# EAGLE schematic ARKnew (EAGLE 9.4.2)
ESKD_DESCRIPTION1: 207|235|224|242|224|32|192|208|202; ESKD_DESCRIPTION2: 241|245|229|236|224|32|253|235|229|234|242|240|232|247|229|241|234|224|255; ESKD_DESCRIPTION3: 239|240|232|237|246|232|239|232|224|235|252|237|224|255; ESKD_NUMBER: 67|67|83|49|46|51|49|48|48|45|48|221|51; ESKD_NUMBER_SHEET: 49; ESKD_SHEETS: 49
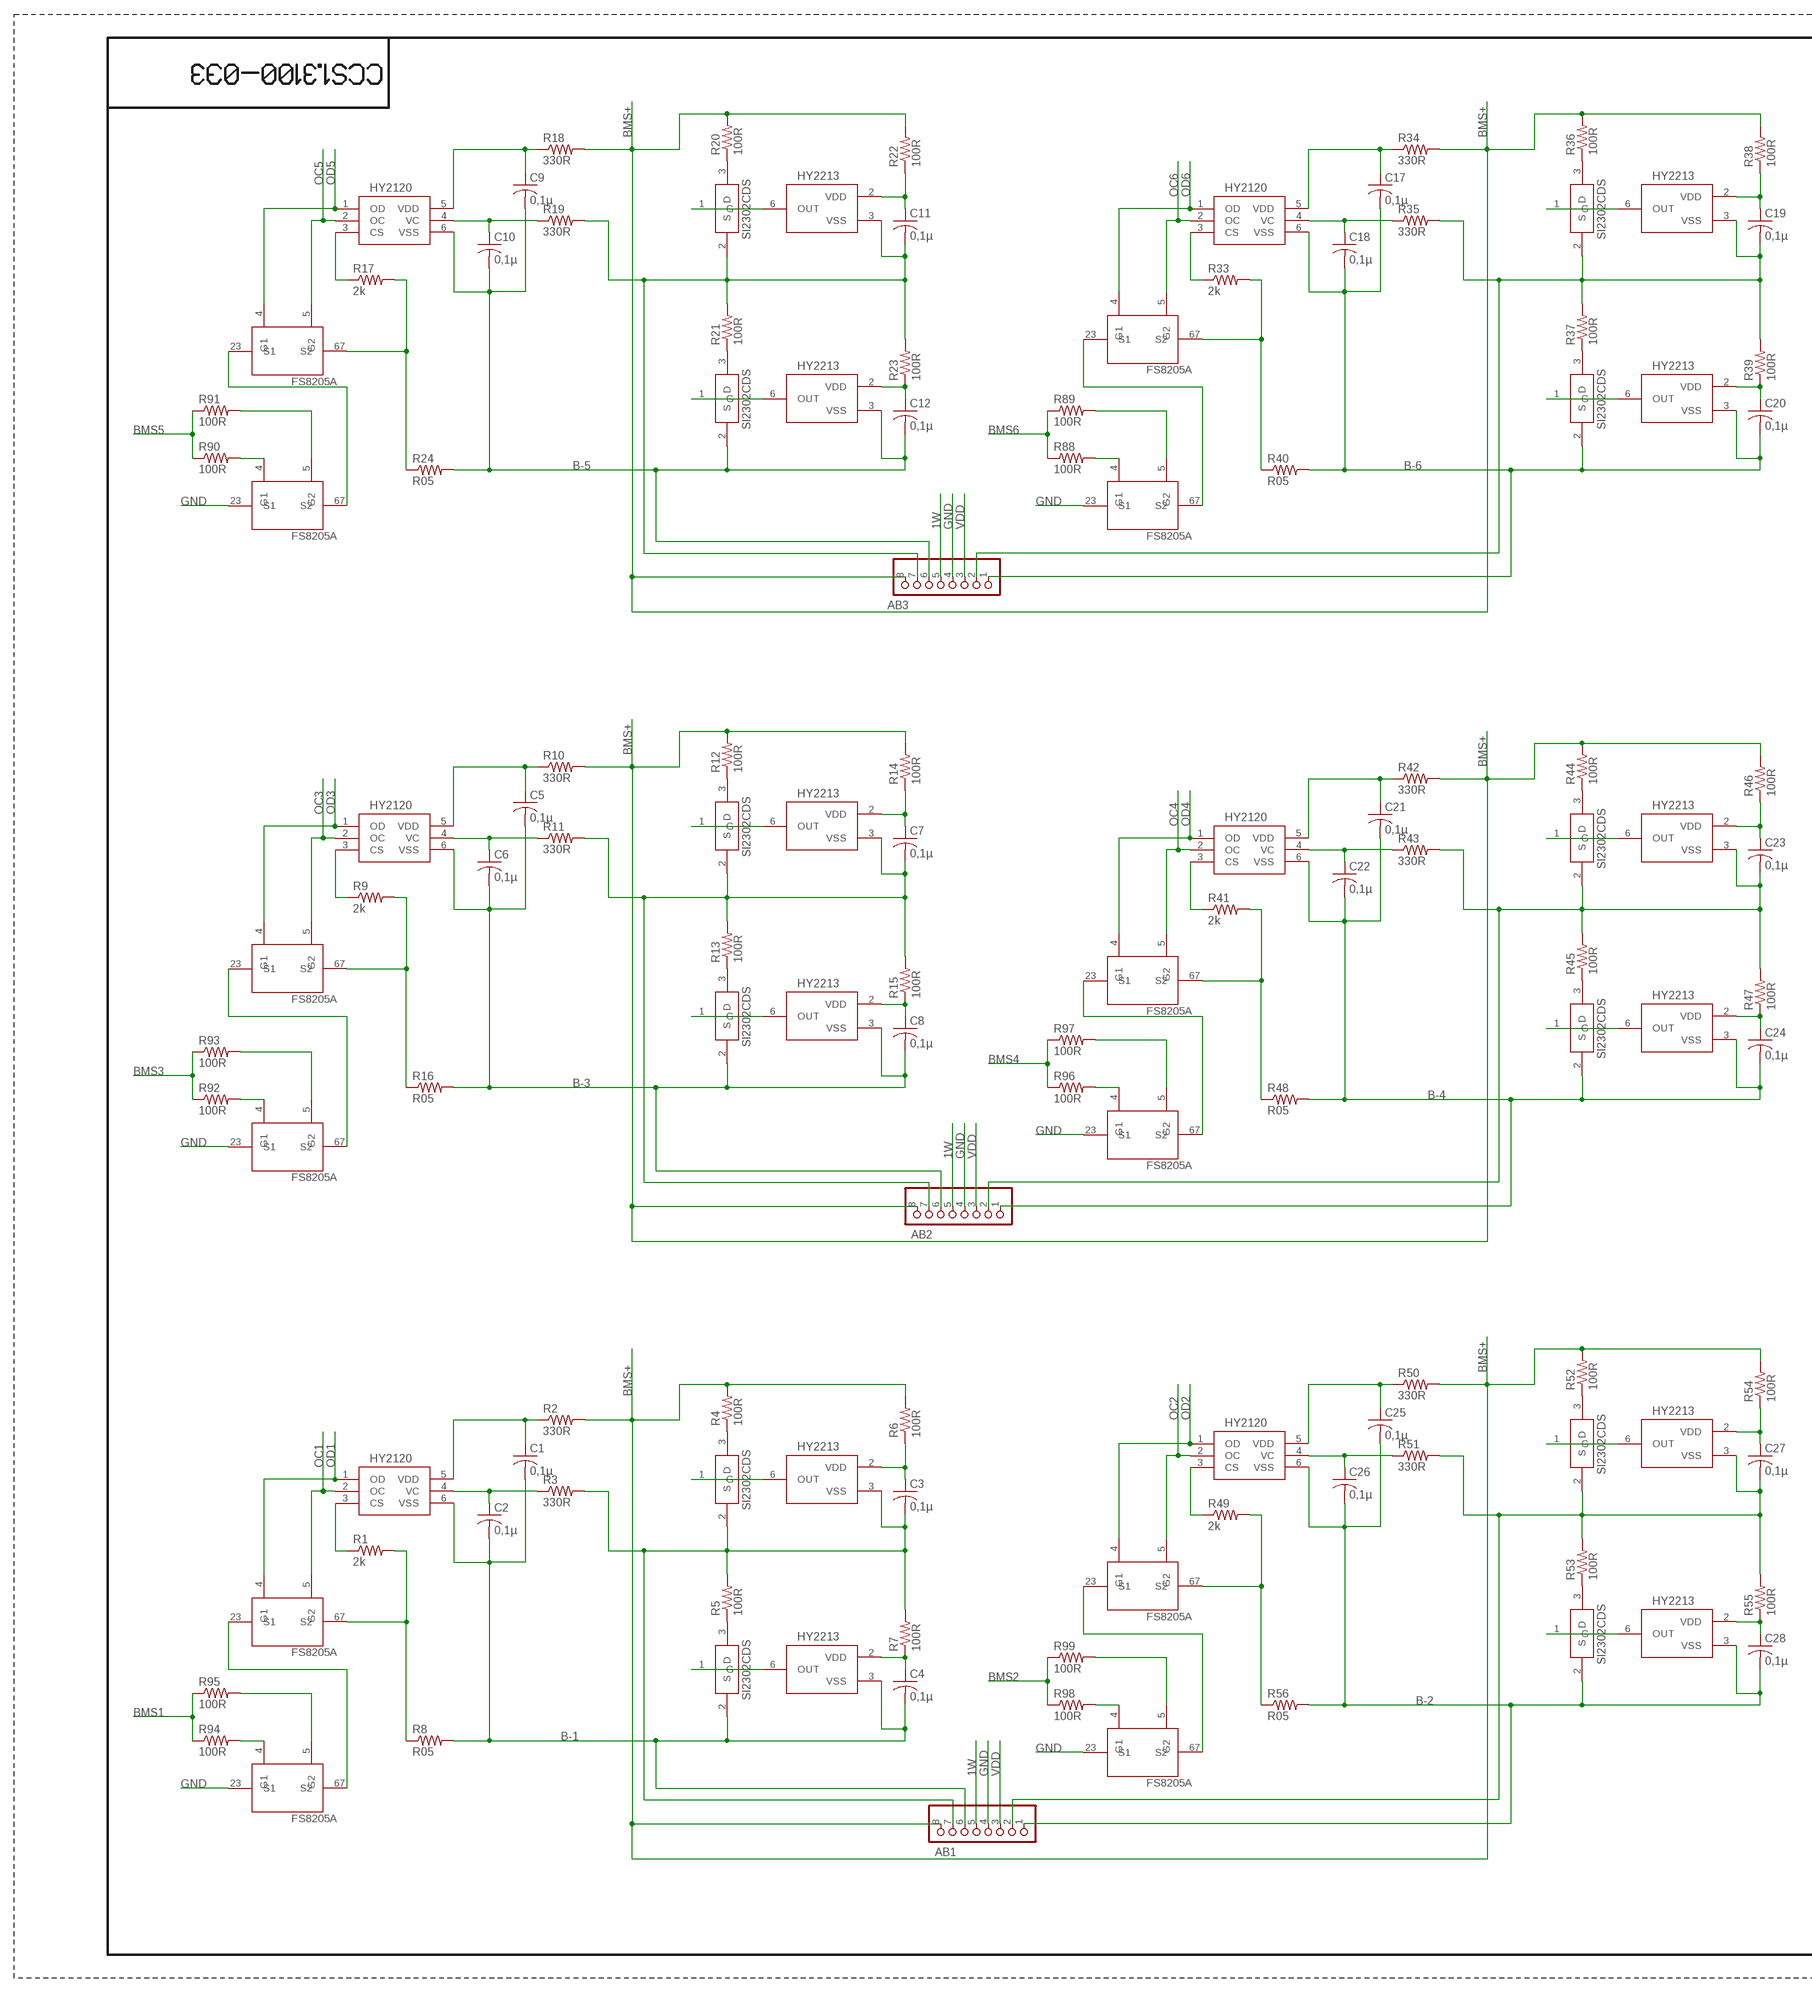
[diagram p0: schematic, sheet 1, part 1 of 2]
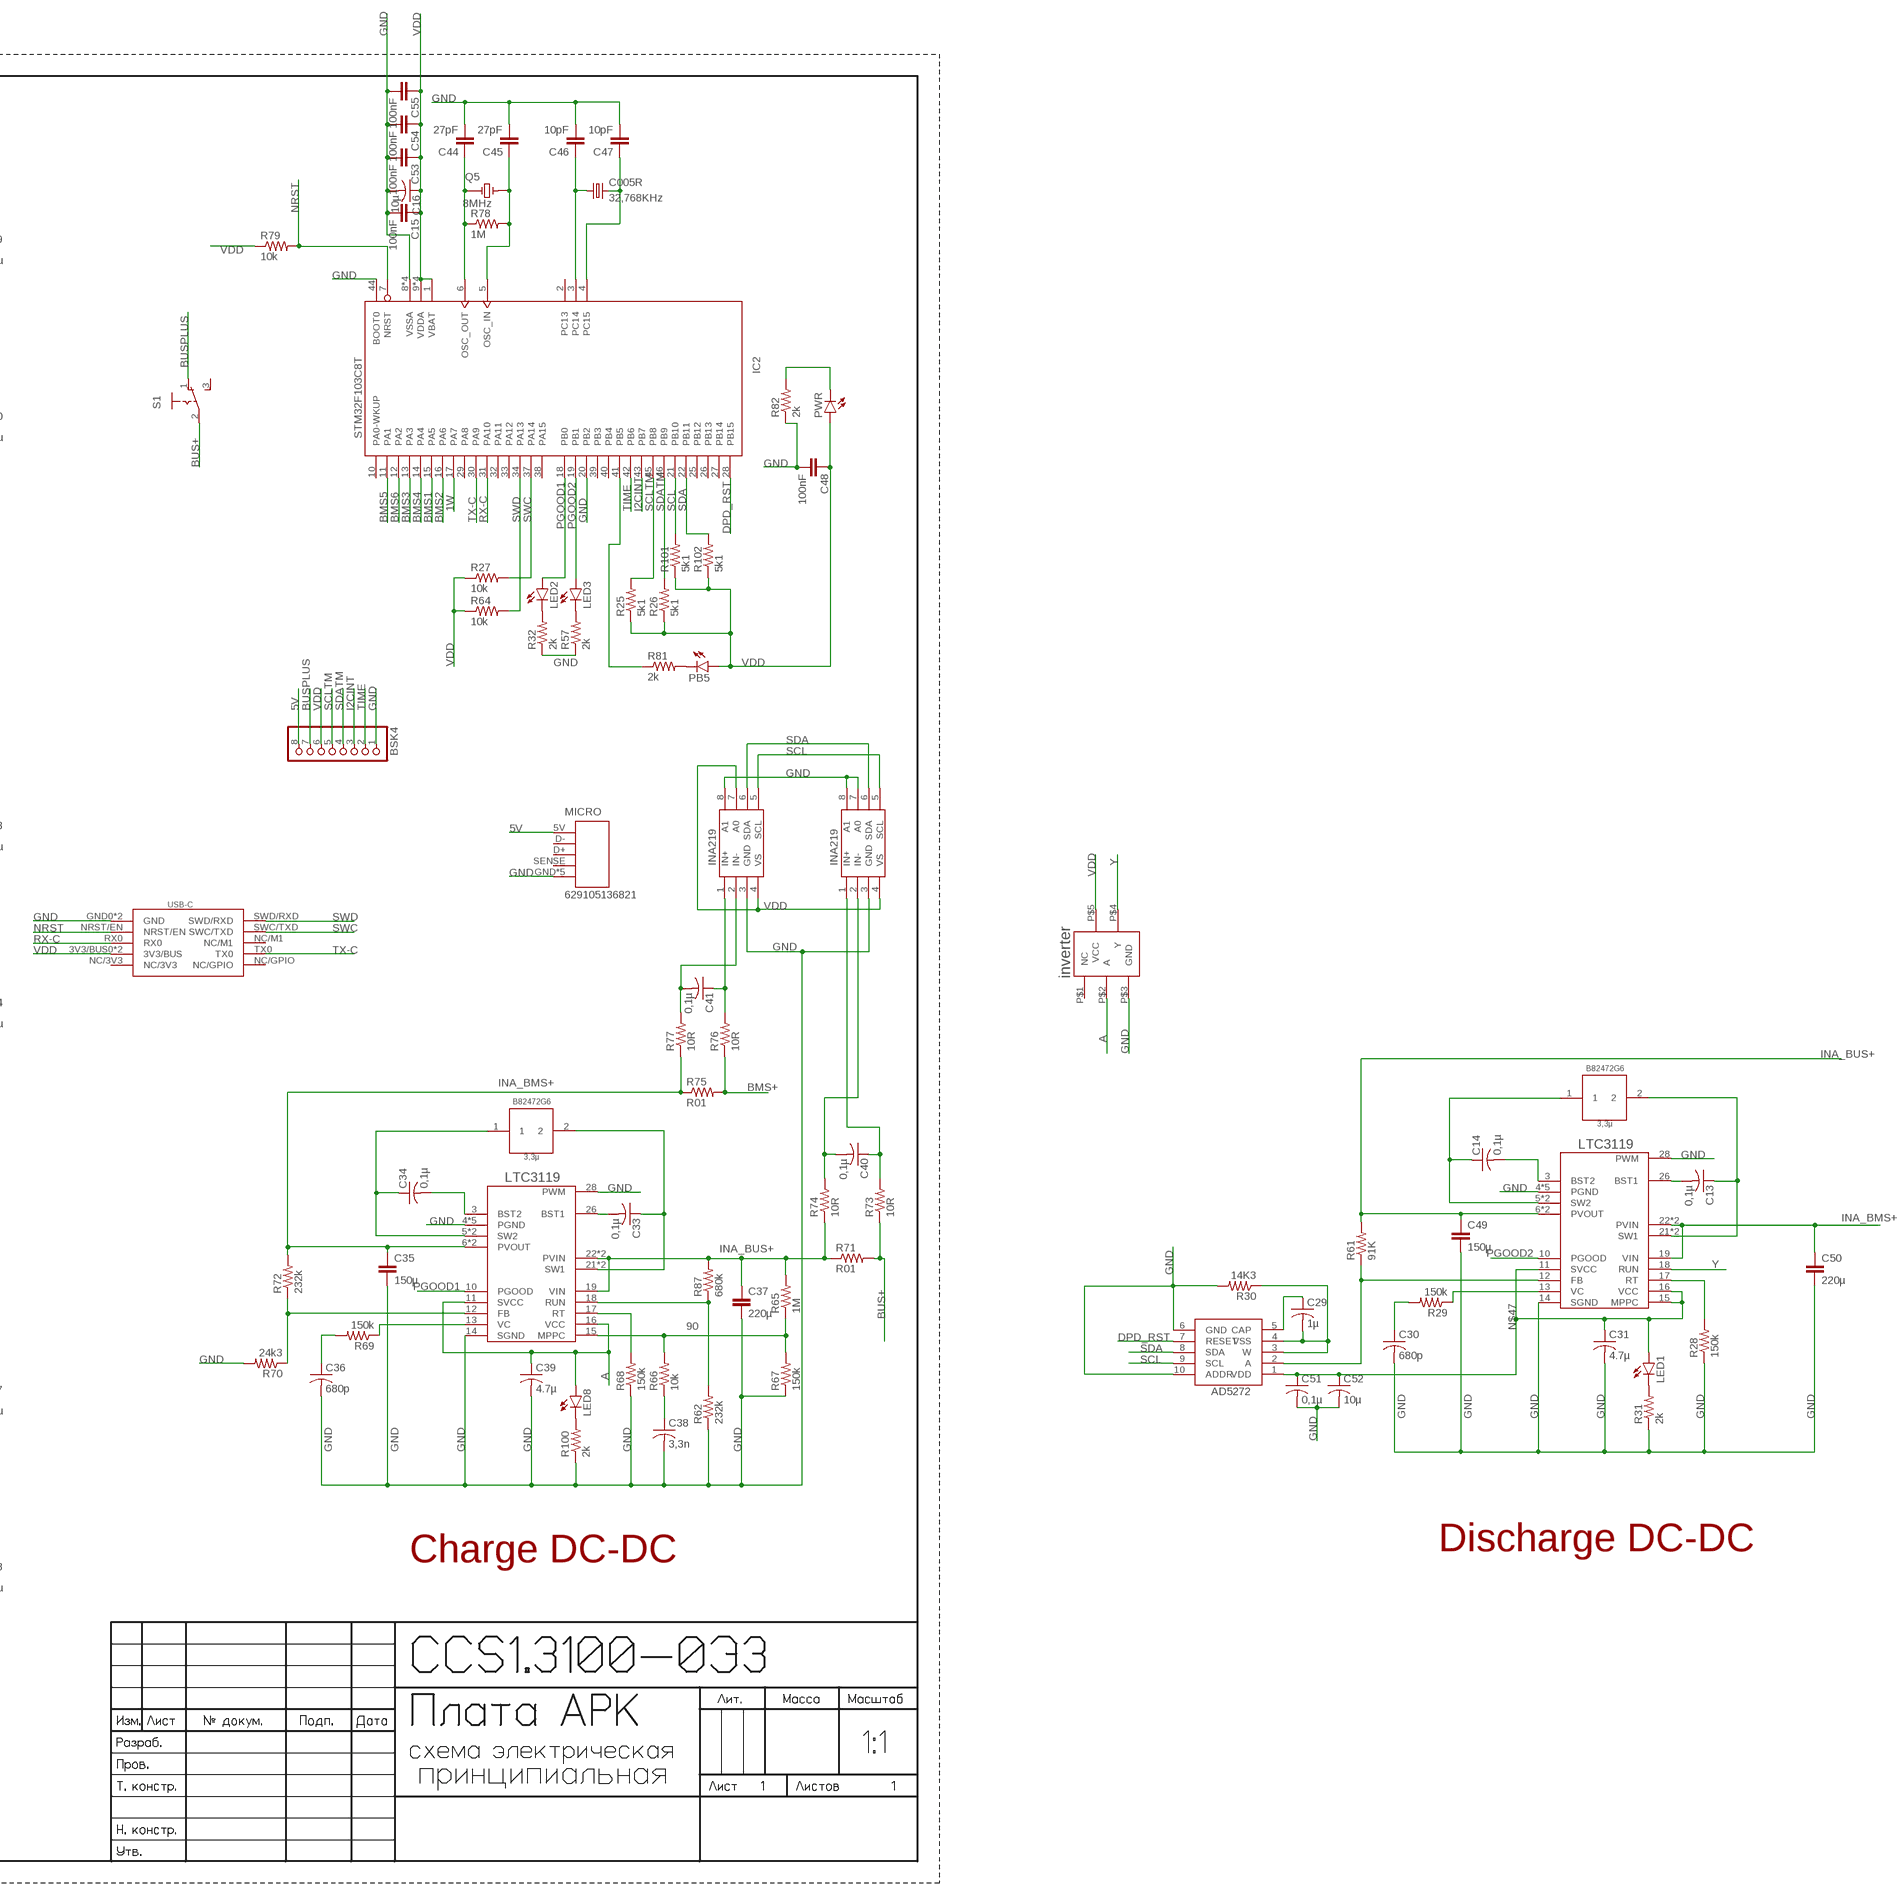
[diagram p1: schematic, sheet 1, part 2 of 2]

## Parts
3,3µH  3,3µ  B82472G6  [B82472G6]
3,3µH1  3,3µ  B82472G6  [B82472G6]
AB1  PINHD-1X8  [1X08]
AB2  PINHD-1X8  [1X08]
AB3  PINHD-1X8  [1X08]
AD5272#2  AD5272  [AD5272]
BSK4  PINHD-1X8  [1X08]
C1  0,1µ  C-USC0603  [C0603]
C2  0,1µ  C-USC0603  [C0603]
C3  0,1µ  C-USC0603  [C0603]
C4  0,1µ  C-USC0603  [C0603]
C5  0,1µ  C-USC0603  [C0603]
C005R  32,768KHz  C005R  [C005R]
C6  0,1µ  C-USC0603  [C0603]
C7  0,1µ  C-USC0603  [C0603]
C8  0,1µ  C-USC0603  [C0603]
C9  0,1µ  C-USC0603  [C0603]
C10  0,1µ  C-USC0603  [C0603]
C11  0,1µ  C-USC0603  [C0603]
C12  0,1µ  C-USC0603  [C0603]
C13  0,1µ  C-USC0603  [C0603]
C14  0,1µ  C-USC0603  [C0603]
C15  100nF  C-EUC0603  [C0603]
C16  10µ  C-USC1206  [C1206]
C17  0,1µ  C-USC0603  [C0603]
C18  0,1µ  C-USC0603  [C0603]
C19  0,1µ  C-USC0603  [C0603]
C20  0,1µ  C-USC0603  [C0603]
C21  0,1µ  C-USC0603  [C0603]
C22  0,1µ  C-USC0603  [C0603]
C23  0,1µ  C-USC0603  [C0603]
C24  0,1µ  C-USC0603  [C0603]
C25  0,1µ  C-USC0603  [C0603]
C26  0,1µ  C-USC0603  [C0603]
C27  0,1µ  C-USC0603  [C0603]
C28  0,1µ  C-USC0603  [C0603]
C29  1µ  C-USC0603  [C0603]
C30  680p  C-USC0603  [C0603]
C31  4.7µ  C-USC1206  [C1206]
C33  0,1µ  C-USC0603  [C0603]
C34  0,1µ  C-USC0603  [C0603]
C35  150µ  ECAPECAP150  [ECAP150]
C36  680p  C-USC0603  [C0603]
C37  220µ  ECAPECAP220  [ECAP220]
C38  3,3n  C-USC0603  [C0603]
C39  4.7µ  C-USC1206  [C1206]
C40  0,1µ  C-USC0603  [C0603]
C41  0,1µ  C-USC0603  [C0603]
C44  27pF  C-EUC0603  [C0603]
C45  27pF  C-EUC0603  [C0603]
C46  10pF  C-EUC0603  [C0603]
C47  10pF  C-EUC0603  [C0603]
C48  100nF  C-EUC0603  [C0603]
C49  150µ  ECAPECAP150  [ECAP150]
C50  220µ  ECAPECAP220  [ECAP220]
C51  0,1µ  C-USC0603  [C0603]
C52  10µ  C-USC1206  [C1206]
C53  100nF  C-EUC0603  [C0603]
C54  100nF  C-EUC0603  [C0603]
C55  100nF  C-EUC0603  [C0603]
IC2  STM32F103C8T  [LQFP48]
INA219#1  INA219AID  [INA219AID]
LED1  LEDCHIPLED_0603  [CHIPLED_0603]
LED2  LEDCHIPLED_0603  [CHIPLED_0603]
LED3  LEDCHIPLED_0603  [CHIPLED_0603]
LED8  LEDCHIPLED_0603  [CHIPLED_0603]
MICRO  629105136821  [629105136821]
PB5  LEDCHIPLED_0603  [CHIPLED_0603]
PWR  LEDCHIPLED_0603  [CHIPLED_0603]
Q5  8MHz  9C-8.000MEEJ-T  [XTAL_9C-8.000MEEJ-T]
R1  2k  R-US_R0603  [R0603]
R2  330R  R-US_R0603  [R0603]
R3  330R  R-US_R0603  [R0603]
R4  100R  R-US_R0603  [R0603]
R5  100R  R-US_R0603  [R0603]
R6  100R  R-US_R0603  [R0603]
R7  100R  R-US_R0603  [R0603]
R8  R05  R-US_R2512  [R2512]
R9  2k  R-US_R0603  [R0603]
R10  330R  R-US_R0603  [R0603]
R11  330R  R-US_R0603  [R0603]
R12  100R  R-US_R0603  [R0603]
R13  100R  R-US_R0603  [R0603]
R14  100R  R-US_R0603  [R0603]
R15  100R  R-US_R0603  [R0603]
R16  R05  R-US_R2512  [R2512]
R17  2k  R-US_R0603  [R0603]
R18  330R  R-US_R0603  [R0603]
R19  330R  R-US_R0603  [R0603]
R20  100R  R-US_R0603  [R0603]
R21  100R  R-US_R0603  [R0603]
R22  100R  R-US_R0603  [R0603]
R23  100R  R-US_R0603  [R0603]
R24  R05  R-US_R2512  [R2512]
R25  5k1  R-US_R0603  [R0603]
R26  5k1  R-US_R0603  [R0603]
R27  10k  R-US_R0603  [R0603]
R28  150k  R-US_R0603  [R0603]
R29  150k  R-US_R0603  [R0603]
R30  14K3  R-US_R0603  [R0603]
R31  2k  R-US_R0603  [R0603]
R32  2k  R-US_R0603  [R0603]
R33  2k  R-US_R0603  [R0603]
R34  330R  R-US_R0603  [R0603]
R35  330R  R-US_R0603  [R0603]
R36  100R  R-US_R0603  [R0603]
R37  100R  R-US_R0603  [R0603]
R38  100R  R-US_R0603  [R0603]
R39  100R  R-US_R0603  [R0603]
R40  R05  R-US_R2512  [R2512]
R41  2k  R-US_R0603  [R0603]
R42  330R  R-US_R0603  [R0603]
R43  330R  R-US_R0603  [R0603]
R44  100R  R-US_R0603  [R0603]
R45  100R  R-US_R0603  [R0603]
R46  100R  R-US_R0603  [R0603]
R47  100R  R-US_R0603  [R0603]
R48  R05  R-US_R2512  [R2512]
R49  2k  R-US_R0603  [R0603]
R50  330R  R-US_R0603  [R0603]
R51  330R  R-US_R0603  [R0603]
R52  100R  R-US_R0603  [R0603]
R53  100R  R-US_R0603  [R0603]
R54  100R  R-US_R0603  [R0603]
R55  100R  R-US_R0603  [R0603]
R56  R05  R-US_R2512  [R2512]
R57  2k  R-US_R0603  [R0603]
R61  91K  R-US_R0603  [R0603]
R62  232k  R-US_R0603  [R0603]
R64  10k  R-US_R0603  [R0603]
R65  1M  R-US_R0603  [R0603]
R66  10k  R-US_R0603  [R0603]
R67  150k  R-US_R0603  [R0603]
R68  150k  R-US_R0603  [R0603]
R69  150k  R-US_R0603  [R0603]
R70  24k3  R-US_R0603  [R0603]
R71  R01  R-US_R2512  [R2512]
R72  232k  R-US_R0603  [R0603]
R73  10R  R-US_R0603  [R0603]
R74  10R  R-US_R0603  [R0603]
R75  R01  R-US_R2512  [R2512]
R76  10R  R-US_R0603  [R0603]
R77  10R  R-US_R0603  [R0603]
R78  1M  R-US_R0603  [R0603]
R79  10k  R-US_R0603  [R0603]
R81  2k  R-US_R0603  [R0603]
R82  2k  R-US_R0603  [R0603]
R87  680k  R-US_R0603  [R0603]
R88  100R  R-US_R0603  [R0603]
R89  100R  R-US_R0603  [R0603]
R90  100R  R-US_R0603  [R0603]
R91  100R  R-US_R0603  [R0603]
R92  100R  R-US_R0603  [R0603]
R93  100R  R-US_R0603  [R0603]
R94  100R  R-US_R0603  [R0603]
R95  100R  R-US_R0603  [R0603]
R96  100R  R-US_R0603  [R0603]
R97  100R  R-US_R0603  [R0603]
R98  100R  R-US_R0603  [R0603]
R99  100R  R-US_R0603  [R0603]
R100  2k  R-US_R0603  [R0603]
R101  5k1  R-US_R0603  [R0603]
R102  5k1  R-US_R0603  [R0603]
S1  UNICS-SWITCH  [UNICS-SWITCH]
U$1  FS8205A-  [FS8205A-]
U$2  INVERTER  [INVERTER]
U$3  HY2120  [HY2120]
U$4  HY2213  [HY2213]
U$5  HY2213  [HY2213]
U$6  SI2302CDS  [SI2302CDS]
U$7  SI2302CDS  [SI2302CDS]
U$8  FS8205A-  [FS8205A-]
U$9  FS8205A-  [FS8205A-]
U$10  HY2120  [HY2120]
U$11  HY2213  [HY2213]
U$12  HY2213  [HY2213]
U$13  SI2302CDS  [SI2302CDS]
U$14  SI2302CDS  [SI2302CDS]
U$15  FS8205A-  [FS8205A-]
U$16  LTC3119  [LTC3119]
U$17  HY2120  [HY2120]
U$18  HY2213  [HY2213]
U$19  HY2213  [HY2213]
U$20  SI2302CDS  [SI2302CDS]
U$21  SI2302CDS  [SI2302CDS]
U$22  FS8205A-  [FS8205A-]
U$23  USB-C  [USB-C]
U$24  FS8205A-  [FS8205A-]
U$25  FS8205A-  [FS8205A-]
U$26  FS8205A-  [FS8205A-]
U$27  FS8205A-  [FS8205A-]
U$28  FS8205A-  [FS8205A-]
U$29  FS8205A-  [FS8205A-]
U$30  FS8205A-  [FS8205A-]
U$31  HY2120  [HY2120]
U$32  HY2213  [HY2213]
U$33  HY2213  [HY2213]
U$34  SI2302CDS  [SI2302CDS]
U$35  SI2302CDS  [SI2302CDS]
U$38  HY2120  [HY2120]
U$39  HY2213  [HY2213]
U$40  HY2213  [HY2213]
U$41  SI2302CDS  [SI2302CDS]
U$42  SI2302CDS  [SI2302CDS]
U$45  HY2120  [HY2120]
U$46  HY2213  [HY2213]
U$47  HY2213  [HY2213]
U$48  SI2302CDS  [SI2302CDS]
U$49  SI2302CDS  [SI2302CDS]
U$57  INA219AID  [INA219AID]
U$59  LTC3119  [LTC3119]

## Nets
1W: AB1.5 AB2.5 AB3.5 IC2.17(PA7)
5V: BSK4.8 MICRO.5V
90: R65.1 R66.2 R67.2 U$59.15(MPPC)
A: C39.1 LED8.A U$2.P$2(A) U$59.11(SVCC) U$59.16(VCC)
B-1: AB1.6 C1.2 C2.2 C4.2 R8.2 U$3.6(VSS) U$5.3(VSS) U$7.2(S)
B-2: AB1.1 C25.2 C26.2 C28.2 R56.2 U$45.6(VSS) U$47.3(VSS) U$49.2(S)
B-3: AB2.6 C5.2 C6.2 C8.2 R16.2 U$10.6(VSS) U$12.3(VSS) U$14.2(S)
B-4: AB2.1 C21.2 C22.2 C24.2 R48.2 U$38.6(VSS) U$40.3(VSS) U$42.2(S)
B-5: AB3.6 C9.2 C10.2 C12.2 R24.2 U$17.6(VSS) U$19.3(VSS) U$21.2(S)
B-6: AB3.1 C17.2 C18.2 C20.2 R40.2 U$31.6(VSS) U$33.3(VSS) U$35.2(S)
BMS1: IC2.15(PA5) R94.1 R95.1
BMS2: IC2.16(PA6) R98.1 R99.1
BMS3: IC2.13(PA3) R92.1 R93.1
BMS4: IC2.14(PA4) R96.1 R97.1
BMS5: IC2.11(PA1) R90.1 R91.1
BMS6: IC2.12(PA2) R88.1 R89.1
BMS+: AB1.8 AB2.8 AB3.8 R2.2 R4.2 R6.2 R10.2 R12.2 R14.2 R18.2 R20.2 R22.2 R34.2 R36.2 R38.2 R42.2 R44.2 R46.2 R50.2 R52.2 R54.2 R75.2 R76.1
BUS+: R71.2 R73.1 S1.2(P)
BUSPLUS: BSK4.7 S1.1(O)
DPD_RST: AD5272#2.7(RESET) IC2.28(PB15)
GND: AB1.4 AB2.4 AB3.4 AD5272#2.6(GND) AD5272#2.10(ADDR) BSK4.1 C15.2 C16.2 C30.2 C31.2 C35.P$2 C36.2 C37.P$2 C38.2 C39.2 C44.2 C45.2 C46.2 C47.2 C48.2 C49.P$2 C50.P$2 C51.2 C52.2 C53.2 C54.2 C55.2 IC2.8(VSSA) IC2.20(PB2) IC2.23(VSSA) IC2.35(VSSA) IC2.44(BOOT0) IC2.47(VSSA) INA219#1.3(GND) INA219#1.7(A0) INA219#1.8(A1) MICRO.GND MICRO.Z1 MICRO.Z2 MICRO.Z3 MICRO.Z4 R28.1 R30.2 R31.1 R32.1 R57.1 R62.1 R67.1 R68.1 R70.2 R82.1 R100.1 U$2.P$3(GND) U$9.23(S1) U$16.4(PGND) U$16.9(PGND) U$16.14(SGND) U$16.20(PGND) U$16.25(PGND) U$16.28(PWM) U$16.29(PGND) U$22.23(S1) U$23.GND0(GND) U$23.GND1(GND) U$27.23(S1) U$28.23(S1) U$29.23(S1) U$30.23(S1) U$57.3(GND) U$57.8(A1) U$59.4(PGND) U$59.9(PGND) U$59.14(SGND) U$59.20(PGND) U$59.25(PGND) U$59.28(PWM) U$59.29(PGND)
I2CINT: BSK4.3 IC2.43(PB7)
INA_BMS+: C35.P$1 C50.P$1 R72.2 R75.1 R77.1 U$16.19(VIN) U$16.22(PVIN) U$16.23(PVIN) U$59.6(PVOUT) U$59.7(PVOUT)
INA_BUS+: C37.P$1 C49.P$1 R61.2 R65.2 R71.1 R74.1 R87.2 U$16.6(PVOUT) U$16.7(PVOUT) U$59.19(VIN) U$59.22(PVIN) U$59.23(PVIN)
N$1: C1.1 R2.1 U$3.5(VDD)
N$2: C4.1 R7.1 U$5.2(VDD)
N$3: R1.1 U$3.3(CS)
N$4: C3.1 R6.1 U$4.2(VDD)
N$5: AD5272#2.2(A) R61.1 U$16.12(FB)
N$6: U$4.6(OUT) U$6.1(G)
N$7: R4.1 U$6.3(D)
N$8: AB1.7 C3.2 R3.2 R5.2 R7.2 U$4.3(VSS) U$6.2(S)
N$9: U$5.6(OUT) U$7.1(G)
N$10: R5.1 U$7.3(D)
N$11: 3,3µH1.2 C13.1 U$16.21(SW1) U$16.24(SW1)
N$12: 3,3µH1.1 C14.1 U$16.5(SW2) U$16.8(SW2)
N$13: R1.2 R8.1 U$26.67(S2)
N$14: C40.2 INA219#1.2(IN-) R74.2
N$15: C2.1 R3.1 U$3.4(VC)
N$16: C5.1 R10.1 U$10.5(VDD)
N$17: PB5.C R81.2
N$18: R9.1 U$10.3(CS)
N$19: C7.1 R14.1 U$11.2(VDD)
N$20: U$11.6(OUT) U$13.1(G)
N$21: R12.1 U$13.3(D)
N$22: U$12.6(OUT) U$14.1(G)
N$23: R13.1 U$14.3(D)
N$24: R9.2 R16.1 U$25.67(S2)
N$25: R70.1 R72.1 U$59.12(FB)
N$26: LED1.C R31.2
N$27: C6.1 R11.1 U$10.4(VC)
N$28: C8.1 R15.1 U$12.2(VDD)
N$29: R28.2 U$16.17(RT)
N$30: AB2.7 C7.2 R11.2 R13.2 R15.2 U$11.3(VSS) U$13.2(S)
N$31: R91.2 U$9.5(G2)
N$32: C13.2 U$16.26(BST1)
N$33: C9.1 R18.1 U$17.5(VDD)
N$34: R17.1 U$17.3(CS)
N$35: C11.1 R22.1 U$18.2(VDD)
N$36: U$18.6(OUT) U$20.1(G)
N$37: R20.1 U$20.3(D)
N$38: U$19.6(OUT) U$21.1(G)
N$39: R21.1 U$21.3(D)
N$40: R17.2 R24.1 U$24.67(S2)
N$41: R29.1 U$16.13(VC)
N$42: C30.1 R29.2
N$43: C10.1 R19.1 U$17.4(VC)
N$44: C12.1 R23.1 U$19.2(VDD)
N$45: R90.2 U$9.4(G1)
N$46: AB3.7 C11.2 R19.2 R21.2 R23.2 U$18.3(VSS) U$20.2(S)
N$47: AD5272#2.1(VDD) C31.1 C51.1 C52.1 LED1.A U$16.11(SVCC) U$16.15(MPPC) U$16.16(VCC)
N$48: AD5272#2.3(W) AD5272#2.4(VSS) C29.2 R30.1
N$49: U$15.23(S1) U$22.67(S2)
N$50: U$9.67(S2) U$24.23(S1)
N$51: AD5272#2.5(CAP) C29.1
N$52: C14.2 U$16.3(BST2)
N$53: R88.2 U$22.4(G1)
N$54: LED2.C R32.2
N$55: R62.2 R87.1 U$59.18(RUN)
N$56: LED3.C R57.2
N$57: R36.1 U$34.3(D)
N$58: R37.1 U$35.3(D)
N$59: R44.1 U$41.3(D)
N$60: LED8.C R100.2
N$61: R89.2 U$22.5(G2)
N$62: U$25.23(S1) U$27.67(S2)
N$63: R93.2 U$27.5(G2)
N$64: R92.2 U$27.4(G1)
N$65: C17.1 R34.1 U$31.5(VDD)
N$66: R33.1 U$31.3(CS)
N$67: C19.1 R38.1 U$32.2(VDD)
N$68: U$32.6(OUT) U$34.1(G)
N$69: R45.1 U$42.3(D)
N$70: U$33.6(OUT) U$35.1(G)
N$71: R52.1 U$48.3(D)
N$72: R33.2 R40.1 U$15.67(S2)
N$73: U$8.23(S1) U$28.67(S2)
N$74: R97.2 U$28.5(G2)
N$75: C18.1 R35.1 U$31.4(VC)
N$76: C20.1 R39.1 U$33.2(VDD)
N$77: R96.2 U$28.4(G1)
N$78: AB3.2 C19.2 R35.2 R37.2 R39.2 U$32.3(VSS) U$34.2(S)
N$79: U$26.23(S1) U$29.67(S2)
N$80: R95.2 U$29.5(G2)
N$81: C21.1 R42.1 U$38.5(VDD)
N$82: R41.1 U$38.3(CS)
N$83: C23.1 R46.1 U$39.2(VDD)
N$84: U$39.6(OUT) U$41.1(G)
N$85: R53.1 U$49.3(D)
N$86: U$40.6(OUT) U$42.1(G)
N$88: R41.2 R48.1 U$8.67(S2)
N$89: R94.2 U$29.4(G1)
N$90: U$1.23(S1) U$30.67(S2)
N$91: C22.1 R43.1 U$38.4(VC)
N$92: C24.1 R47.1 U$40.2(VDD)
N$93: R99.2 U$30.5(G2)
N$94: AB2.2 C23.2 R43.2 R45.2 R47.2 U$39.3(VSS) U$41.2(S)
N$95: R98.2 U$30.4(G1)
N$97: C25.1 R50.1 U$45.5(VDD)
N$98: R49.1 U$45.3(CS)
N$99: C27.1 R54.1 U$46.2(VDD)
N$100: U$46.6(OUT) U$48.1(G)
N$102: U$47.6(OUT) U$49.1(G)
N$104: R49.2 R56.1 U$1.67(S2)
N$107: C26.1 R51.1 U$45.4(VC)
N$108: C28.1 R55.1 U$47.2(VDD)
N$110: AB1.2 C27.2 R51.2 R53.2 R55.2 U$46.3(VSS) U$48.2(S)
N$129: C34.2 U$59.3(BST2)
N$131: 3,3µH.2 C33.1 U$59.21(SW1) U$59.24(SW1)
N$132: 3,3µH.1 C34.1 U$59.5(SW2) U$59.8(SW2)
N$133: C44.1 IC2.6(OSC_OUT) Q5.1 R78.1
N$135: R69.1 U$59.13(VC)
N$136: C36.1 R69.2
N$139: C38.1 R66.1
N$142: R68.2 U$59.17(RT)
N$144: C33.2 U$59.26(BST1)
N$145: C45.1 IC2.5(OSC_IN) Q5.2 R78.2
N$147: C40.1 INA219#1.1(IN+) R73.2
N$148: C005R.P$2 C47.1 IC2.4(PC15)
N$150: C41.1 R76.2 U$57.1(IN+)
N$151: C41.2 R77.2 U$57.2(IN-)
N$152: C005R.P$1 C46.1 IC2.3(PC14)
N$159: PWR.C R82.2
N$161: IC2.41(PB5) R81.1
NRST: IC2.7(NRST) R79.2 U$23.NRST/EN
OC1: U$3.2(OC) U$26.5(G2)
OC2: U$1.5(G2) U$45.2(OC)
OC3: U$10.2(OC) U$25.5(G2)
OC4: U$8.5(G2) U$38.2(OC)
OC5: U$17.2(OC) U$24.5(G2)
OC6: U$15.5(G2) U$31.2(OC)
OD1: U$3.1(OD) U$26.4(G1)
OD2: U$1.4(G1) U$45.1(OD)
OD3: U$10.1(OD) U$25.4(G1)
OD4: U$8.4(G1) U$38.1(OD)
OD5: U$17.1(OD) U$24.4(G1)
OD6: U$15.4(G1) U$31.1(OD)
PGOOD1: IC2.18(PB0) LED2.A U$59.10(PGOOD)
PGOOD2: IC2.19(PB1) LED3.A U$16.10(PGOOD)
RX-C: IC2.31(PA10) U$23.RX0
SCL: AD5272#2.9(SCL) IC2.21(PB10) INA219#1.5(SCL) R101.2 U$57.5(SCL)
SCLTM: BSK4.5 IC2.45(PB8) R25.2
SDA: AD5272#2.8(SDA) IC2.22(PB11) INA219#1.6(SDA) R102.2 U$57.6(SDA)
SDATM: BSK4.4 IC2.46(PB9) R26.2
SWC: IC2.37(PA14) R27.2 U$23.SWC/TXD
SWD: IC2.34(PA13) R64.2 U$23.SWD/RXD
TIME: BSK4.2 IC2.42(PB6)
TX-C: IC2.30(PA9) U$23.TX0
VDD: AB1.3 AB2.3 AB3.3 BSK4.6 C15.1 C16.1 C48.1 C53.1 C54.1 C55.1 IC2.1(VBAT) IC2.9(VDDA) IC2.24(VDDA) IC2.36(VDDA) IC2.48(VDDA) INA219#1.4(VS) PB5.A PWR.A R25.1 R26.1 R27.1 R64.1 R79.1 R101.1 R102.1 U$2.P$5(VCC) U$23.3V3/BUS0(3V3/BUS) U$23.3V3/BUS1(3V3/BUS) U$57.4(VS) U$57.7(A0)
Y: U$2.P$4(Y) U$16.18(RUN)
Unconnected: IC2.2(PC13) IC2.10(PA0-WKUP) IC2.25(PB12) IC2.26(PB13) IC2.27(PB14) IC2.29(PA8) IC2.32(PA11) IC2.33(PA12) IC2.38(PA15) IC2.39(PB3) IC2.40(PB4) MICRO.D+ MICRO.D- MICRO.SENSE S1.3(S) U$2.P$1(NC) U$23.NC/3V3 U$23.NC/GPIO U$23.NC/M1

## Notes on the sheet
- Charge DC-DC | Discharge DC-DC

## Library data of the parts
3,3µH 3,3µH1 = CanCubeSat:B82472G6
AB1-AB3 BSK4 = pinheadCS:PINHD-1X8: PIN HEADER
AD5272#2 = CanCubeSat:AD5272
C1-C14 C16-C31 C33 C34 C36 C38-C41 C51 C52 = rcl:C-US: CAPACITOR, American symbol; SPICEPREFIX: C
C005R = CanCubeSat:C005R
C15 C44-C48 C53-C55 = rcl:C-EU: CAPACITOR, European symbol; SPICEPREFIX: C
C35 C37 C49 C50 = CanCubeSat:ECAP
IC2 = CanCubeSat:STM32F103C*T: ARM 32-bit Cortex™-M3 CPU 72 MHz maximum frequency 16 to 128 Kbytes of Flash memory 6 to 20 kbytes of SRAM 37 GPIOs 2.0 to 3.6 V application supply
INA219#1 U$57 = CanCubeSat:INA219AID
LED1-LED3 LED8 PB5 PWR = led:LED: LED OSRAM: - CHIPLED LG R971, LG N971, LY N971, LG Q971, LY Q971, LO R971, LY R971 LH N974, LH R974 LS Q976, LO Q976, LY Q976 LO Q996 - Hyper CHIPLED LW Q18S LB Q993, LB Q99A, LB R99A - SideLED LS A670, LO A670, LY A670, LG A670, LP A670 LB A673, LV A673, LT A673, LW A673 LH A674 LY A675 LS A676, LA A676, LO A676, LY A676, LW A676 LS A679, LY A679, LG A679 - Hyper Micro SIDELED® LS Y876, LA Y876, LO Y876, LY Y876 LT Y87S - SmartLED LW L88C, LW L88S LB L89C, LB L89S, LG L890 LS L89K, LO L89K, LY L89K LS L896, LA L896, LO L896, LY L896 - TOPLED LS T670, LO T670, LY T670, LG T670, LP T670 LSG T670, LSP T670, LSY T670, LOP T670, LYG T670 LG T671, LOG T671, LSG T671 LB T673, LV T673, LT T673, LW T673 LH T674 LS T676, LA T676, LO T676, LY T676, LB T676, LH T676, LSB T676, LW T676 LB T67C, LV T67C, LT T67C, LS T67K, LO T67K, LY T67K, LW E67C LS E67B, LA E67B, LO E67B, LY E67B, LB E67C, LV E67C, LT E67C LW T67C LS T679, LY T679, LG T679 LS T770, LO T770, LY T770, LG T770, LP T770 LB T773, LV T773, LT T773, LW T773 LH T774 LS E675, LA E675, LY E675, LS T675 LS T776, LA T776, LO T776, LY T776, LB T776 LHGB T686 LT T68C, LB T68C - Hyper Mini TOPLED® LB M676 - Mini TOPLED Santana® LG M470 LS M47K, LO M47K, LY M47K Source: http://www.osram.convergy.de LUXEON: - LUMILED® LXK2-PW12-R00, LXK2-PW12-S00, LXK2-PW14-U00, LXK2-PW14-V00 LXK2-PM12-R00, LXK2-PM12-S00, LXK2-PM14-U00 LXK2-PE12-Q00, LXK2-PE12-R00, LXK2-PE12-S00, LXK2-PE14-T00, LXK2-PE14-U00 LXK2-PB12-K00, LXK2-PB12-L00, LXK2-PB12-M00, LXK2-PB14-N00, LXK2-PB14-P00, LXK2-PB14-Q00 LXK2-PR12-L00, LXK2-PR12-M00, LXK2-PR14-Q00, LXK2-PR14-R00 LXK2-PD12-Q00, LXK2-PD12-R00, LXK2-PD12-S00 LXK2-PH12-R00, LXK2-PH12-S00 LXK2-PL12-P00, LXK2-PL12-Q00, LXK2-PL12-R00 Source: www.luxeon.com KINGBRIGHT: KA-3528ASYC Source: www.kingbright.com
MICRO = MicroUSB:629105136821: WR-COM SMT Horizontal 5 Contacts Micro USB Type B,5 pins
Q5 = 9C-8.000MEEJ-T:9C-8.000MEEJ-T: Crystal, 8mhz, 18pf, Hc-49s; AVAILABILITY: Unavailable; DESCRIPTION: Crystal, 8mhz, 18pf, Hc-49s; MF: TXC CORPORATION; MP: 9C-8.000MEEJ-T; PACKAGE: HC49/US TXC; PRICE: None
R1-R7 R9-R15 R17-R23 R25-R39 R41-R47 R49-R55 R57 R61 R62 R64-R70 R72-R74 R76-R79 R81 R82 R87-R102 = resistor:R-US_: RESISTOR, American symbol
R8 R16 R24 R40 R48 R56 R71 R75 = rcl:R-US_: RESISTOR, American symbol; SPICEPREFIX: R
S1 = cansat-lib:UNICS-SWITCH: SLIDING SWITCH Distributor Buerklin, 11G810
U$1 U$8 U$9 U$15 U$22 U$24-U$30 = CanCubeSat:FS8205A-
U$2 = CanCubeSat:INVERTER
U$3 U$10 U$17 U$31 U$38 U$45 = CanCubeSat:HY2120
U$4 U$5 U$11 U$12 U$18 U$19 U$32 U$33 U$39 U$40 U$46 U$47 = CanCubeSat:HY2213
U$6 U$7 U$13 U$14 U$20 U$21 U$34 U$35 U$41 U$42 U$48 U$49 = CanCubeSat:SI2302CDS
U$16 U$59 = CanCubeSat:LTC3119
U$23 = CanCubeSat:USB-C